# EAGLE design vco (EAGLE 7.4.0)

## Sheet 1 of 2
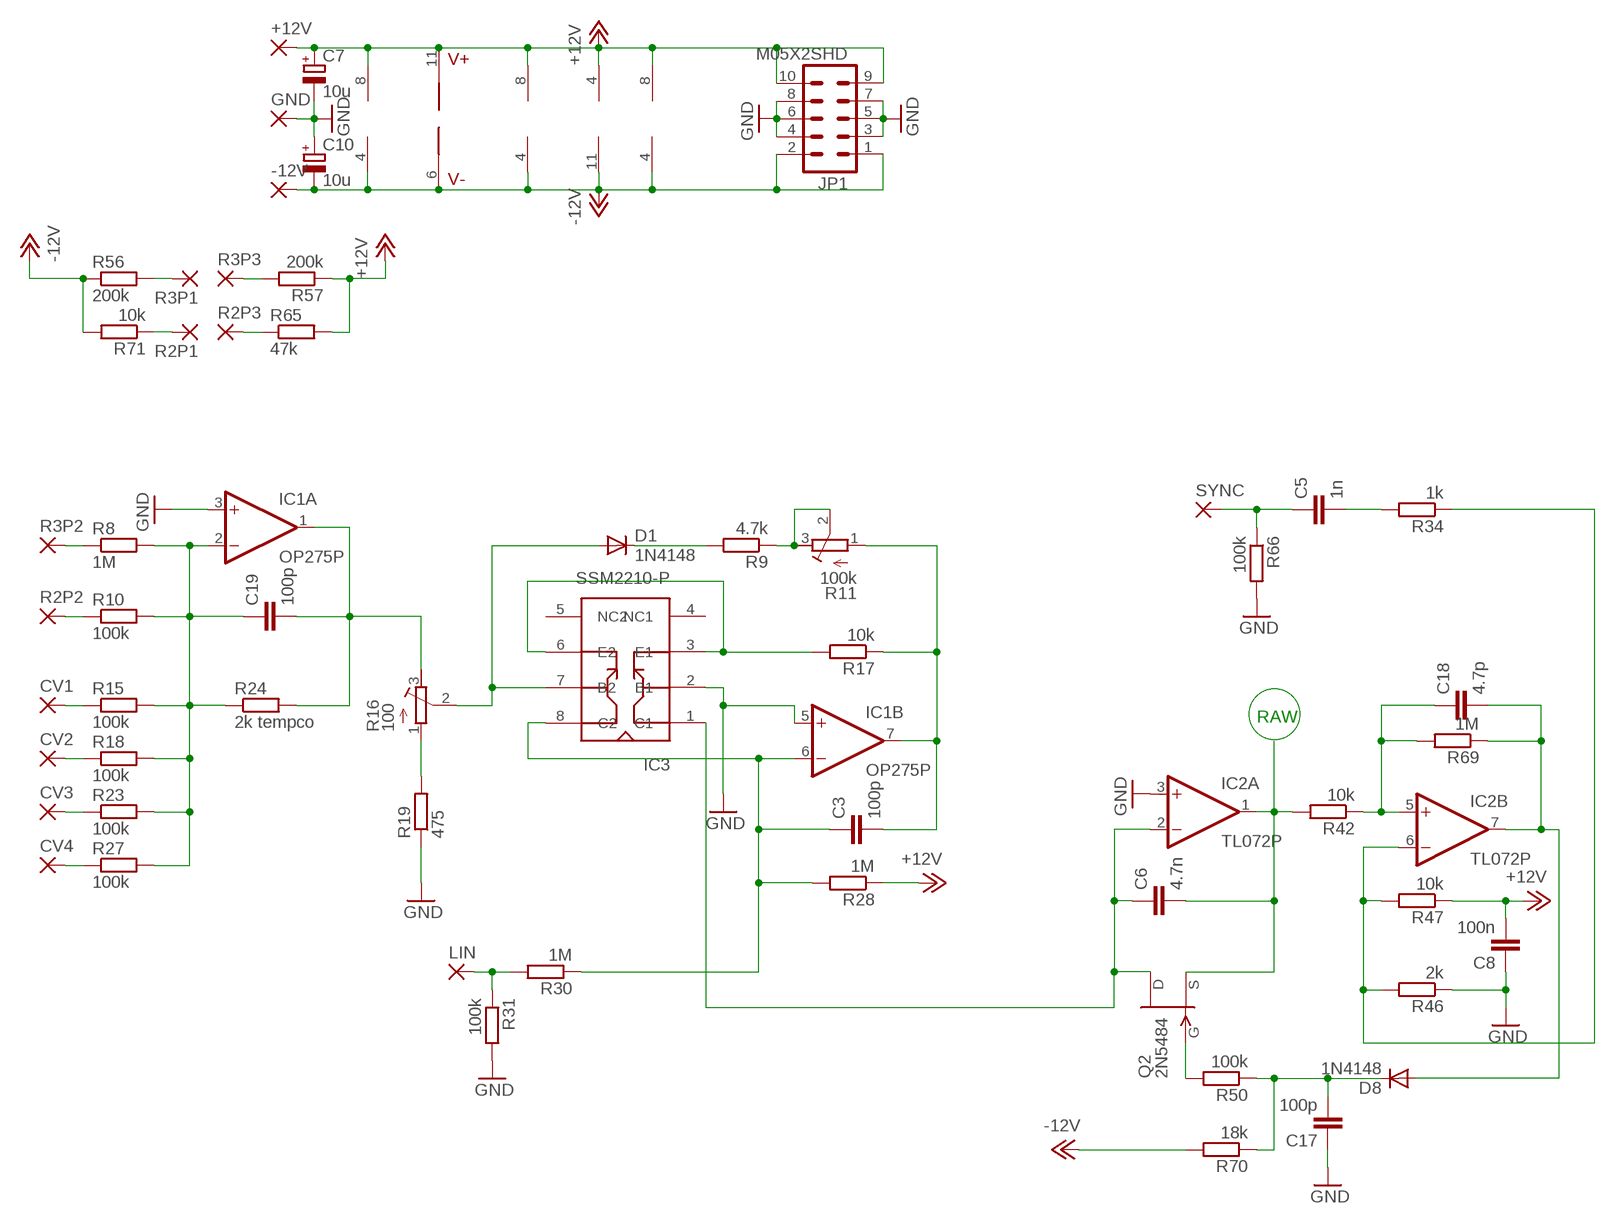
[diagram p0: schematic, sheet 1]

### Parts
+12V  2,54/1,0  [2,54/1,0]
-12V  2,54/1,0  [2,54/1,0]
C3  100p  C-EU050-045X075  [C050-045X075]
C5  1n  C-EU050-045X075  [C050-045X075]
C6  4.7n  C-EU050-045X075  [C050-045X075]
C7  10u  CPOL-EUE2.5-7  [E2,5-7]
C8  100n  C-EU050-045X075  [C050-045X075]
C10  10u  CPOL-EUE2.5-7  [E2,5-7]
C17  100p  C-EU050-045X075  [C050-045X075]
C18  4.7p  C-EU050-045X075  [C050-045X075]
C19  100p  C-EU050-045X075  [C050-045X075]
CV1  2,54/1,0  [2,54/1,0]
CV2  2,54/1,0  [2,54/1,0]
CV3  2,54/1,0  [2,54/1,0]
CV4  2,54/1,0  [2,54/1,0]
D1  1N4148  1N4148DO35-7  [DO35-7]
D8  1N4148  1N4148DO35-7  [DO35-7]
GND  2,54/1,0  [2,54/1,0]
IC1  OP275P  [DIL08]
IC2  TL072P  [DIL08]
IC3  SSM2210-P  [DIL08]
IC4  TL074P  [DIL14]
IC5  LM13700N  [DIL16]
IC6  TL072P  [DIL08]
JP1  M05X2SHD  [2X5-SHROUDED]
LIN  2,54/1,0  [2,54/1,0]
Q2  2N5484  [TO92-]
R2P1  2,54/1,0  [2,54/1,0]
R2P2  2,54/1,0  [2,54/1,0]
R2P3  2,54/1,0  [2,54/1,0]
R3P1  2,54/1,0  [2,54/1,0]
R3P2  2,54/1,0  [2,54/1,0]
R3P3  2,54/1,0  [2,54/1,0]
R8  1M  R-EU_0309/V  [0309V]
R9  4.7k  R-EU_0309/V  [0309V]
R10  100k  R-EU_0309/V  [0309V]
R11  100k  R-TRIMM64W  [RTRIM64W]
R15  100k  R-EU_0309/V  [0309V]
R16  100  R-TRIMM64W  [RTRIM64W]
R17  10k  R-EU_0309/V  [0309V]
R18  100k  R-EU_0309/V  [0309V]
R19  475  R-EU_0309/V  [0309V]
R23  100k  R-EU_0309/V  [0309V]
R24  2k tempco  R-EU_0309/12  [0309/12]
R27  100k  R-EU_0309/V  [0309V]
R28  1M  R-EU_0309/V  [0309V]
R30  1M  R-EU_0309/V  [0309V]
R31  100k  R-EU_0309/V  [0309V]
R34  1k  R-EU_0309/V  [0309V]
R42  10k  R-EU_0309/V  [0309V]
R46  2k  R-EU_0309/V  [0309V]
R47  10k  R-EU_0309/V  [0309V]
R50  100k  R-EU_0309/V  [0309V]
R56  200k  R-EU_0309/V  [0309V]
R57  200k  R-EU_0309/V  [0309V]
R65  47k  R-EU_0309/V  [0309V]
R66  100k  R-EU_0309/V  [0309V]
R69  1M  R-EU_0309/V  [0309V]
R70  18k  R-EU_0309/V  [0309V]
R71  10k  R-EU_0309/V  [0309V]
SYNC  2,54/1,0  [2,54/1,0]

### Nets
+12V: +12V.1(P) C7.+ C8.2 IC1.8(P:V+) IC2.8(P:V+) IC4.4(P:V+) IC5.11(V+) IC6.8(P:V+) JP1.9 JP1.10 R28.1 R47.1 R57.1 R65.2 ; also sheet 2
-12V: -12V.1(P) C10.- IC1.4(P:V-) IC2.4(P:V-) IC4.11(P:V-) IC5.6(V-) IC6.4(P:V-) JP1.1 JP1.2 R56.1 R70.2 R71.2 ; also sheet 2
GND: C7.- C8.1 C10.+ C17.1 GND.1(P) IC1.3(A:+IN) IC1.5(B:+IN) IC2.3(A:+IN) IC3.2(B1) JP1.3 JP1.4 JP1.5 JP1.6 JP1.7 JP1.8 R19.1 R31.2 R46.1 R66.2 ; also sheet 2
N$1: R3P1.1(P) R56.2
N$2: R2P1.1(P) R71.1
N$3: R2P3.1(P) R65.1
N$4: R3P3.1(P) R57.2
N$5: R3P2.1(P) R8.1
N$6: R2P2.1(P) R10.1
N$7: CV1.1(P) R15.1
N$8: CV2.1(P) R18.1
N$9: CV3.1(P) R23.1
N$10: CV4.1(P) R27.1
N$11: C19.1 IC1.2(A:-IN) R8.2 R10.2 R15.2 R18.2 R23.2 R24.1 R27.2
N$12: C19.2 IC1.1(A:OUT) R16.3(E) R24.2
N$13: Q2.1(G) R50.2
N$14: R16.1(A) R19.2
N$15: LIN.1(P) R30.2 R31.1
N$16: C3.1 IC1.6(B:-IN) IC3.8(C2) R28.2 R30.1
N$17: C3.2 IC1.7(B:OUT) R11.1(A) R17.1
N$18: IC3.3(E1) IC3.6(E2) R17.2
N$19: C17.2 D8.C R50.1 R70.1
N$20: C6.1 IC2.2(A:-IN) IC3.1(C1) Q2.3(D)
N$22: D1.A IC3.7(B2) R16.2(S)
N$23: D1.C R9.2
N$24: R9.1 R11.2(S) R11.3(E)
N$25: C18.1 IC2.5(B:+IN) R42.1 R69.2
N$26: C18.2 D8.A IC2.7(B:OUT) R69.1
N$27: IC2.6(B:-IN) R34.1 R46.2 R47.2
N$28: C5.2 R34.2
N$29: C5.1 R66.1 SYNC.1(P)
RAW: C6.2 IC2.1(A:OUT) Q2.2(S) R42.2 ; also sheet 2
Unconnected: IC3.4(NC1) IC3.5(NC2)

### Notes on the sheet
- RAW

## Sheet 2 of 2
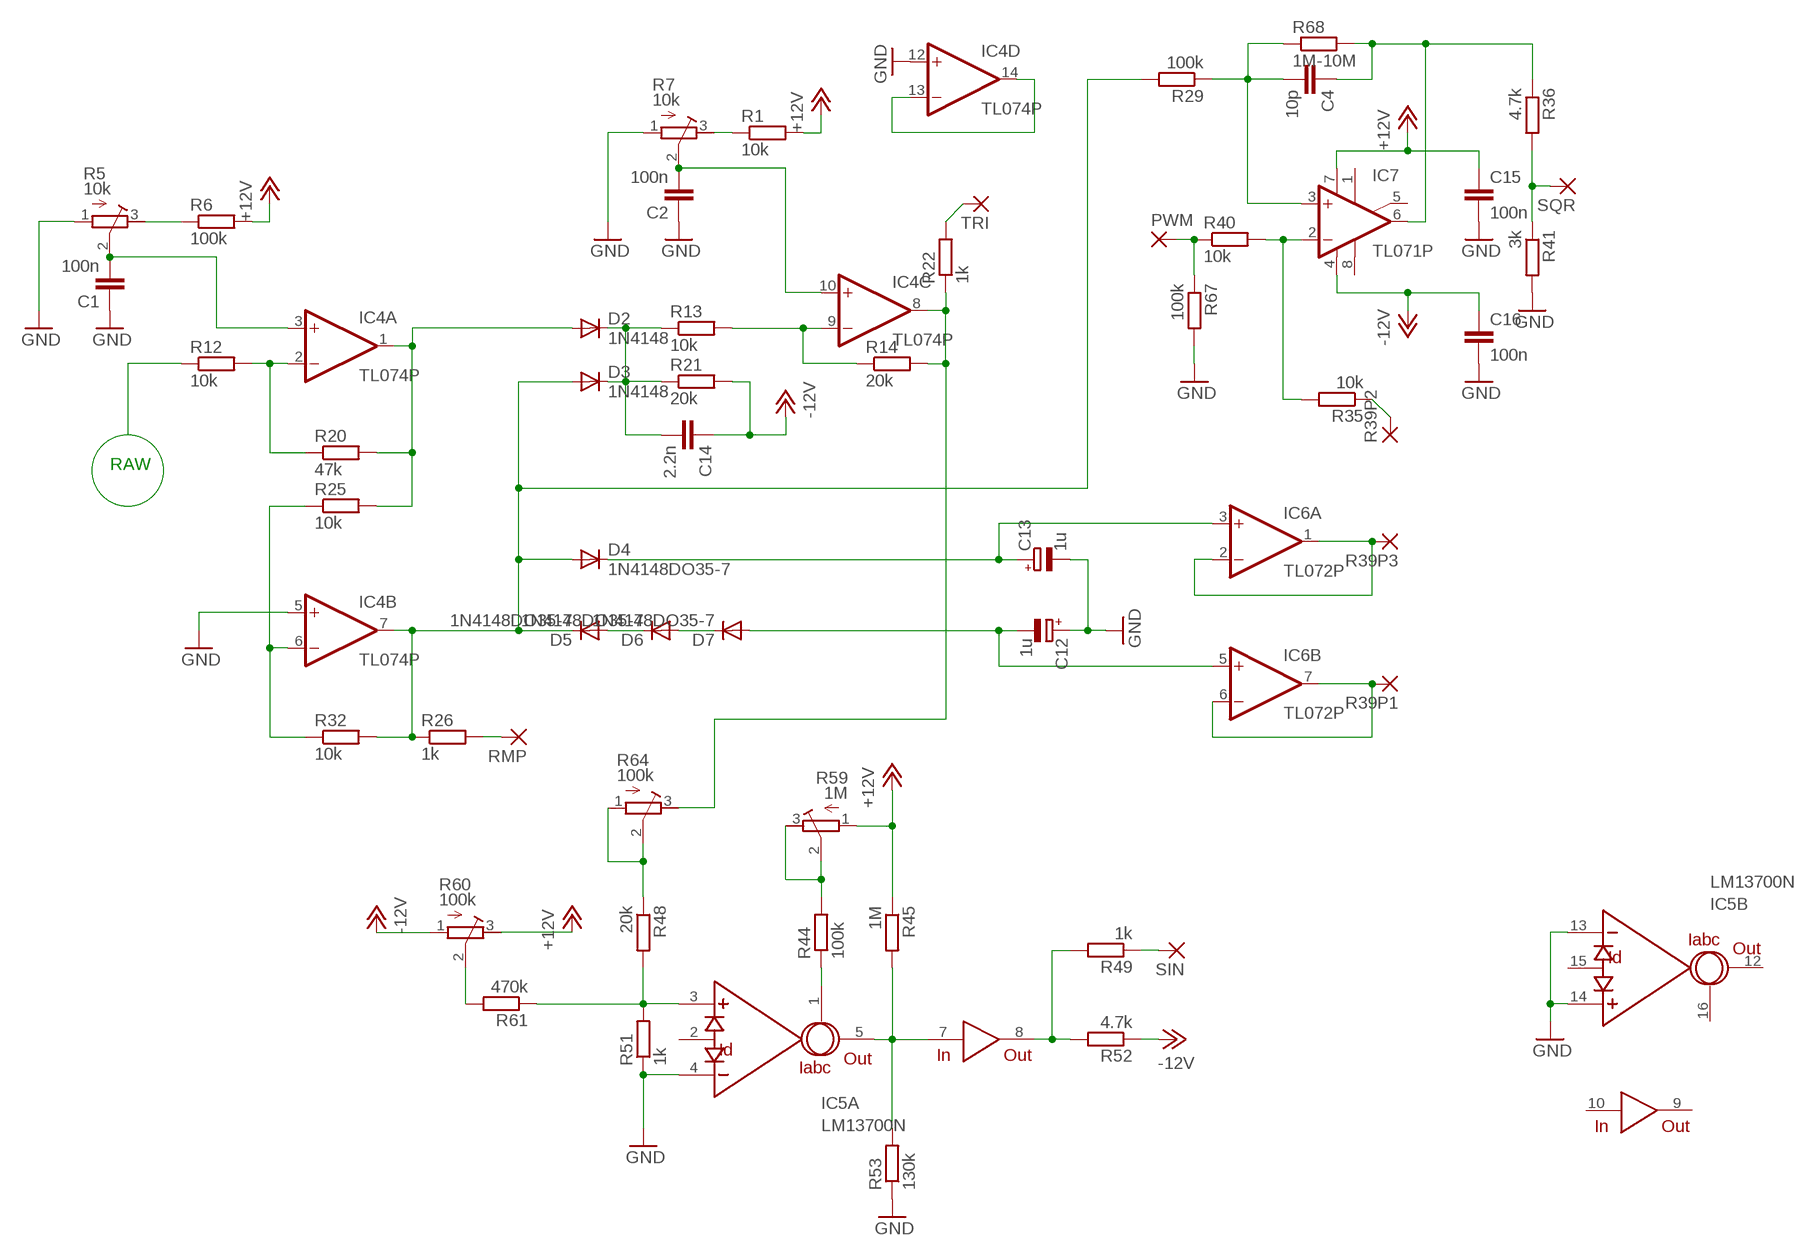
[diagram p1: schematic, sheet 2]

### Parts
C1  100n  C-EU050-045X075  [C050-045X075]
C2  100n  C-EU050-045X075  [C050-045X075]
C4  10p  C-EU050-045X075  [C050-045X075]
C12  1u  CPOL-EUE2.5-7  [E2,5-7]
C13  1u  CPOL-EUE2.5-7  [E2,5-7]
C14  2.2n  C-EU050-045X075  [C050-045X075]
C15  100n  C-EU050-035X075  [C050-035X075]
C16  100n  C-EU050-035X075  [C050-035X075]
D2  1N4148  1N4148DO35-7  [DO35-7]
D3  1N4148  1N4148DO35-7  [DO35-7]
D4  1N4148DO35-7  [DO35-7]
D5  1N4148DO35-7  [DO35-7]
D6  1N4148DO35-7  [DO35-7]
D7  1N4148DO35-7  [DO35-7]
IC7  TL071P  [DIL08]
PWM  2,54/1,0  [2,54/1,0]
R1  10k  R-EU_0309/V  [0309V]
R5  10k  R-TRIMM64W  [RTRIM64W]
R6  100k  R-EU_0309/V  [0309V]
R7  10k  R-TRIMM64W  [RTRIM64W]
R12  10k  R-EU_0309/V  [0309V]
R13  10k  R-EU_0309/10  [0309/10]
R14  20k  R-EU_0309/V  [0309V]
R20  47k  R-EU_0309/V  [0309V]
R21  20k  R-EU_0309/V  [0309V]
R22  1k  R-EU_0309/V  [0309V]
R25  10k  R-EU_0309/V  [0309V]
R26  1k  R-EU_0309/V  [0309V]
R29  100k  R-EU_0309/V  [0309V]
R32  10k  R-EU_0309/V  [0309V]
R35  10k  R-EU_0309/V  [0309V]
R36  4.7k  R-EU_0309/V  [0309V]
R39P1  2,54/1,0  [2,54/1,0]
R39P2  2,54/1,0  [2,54/1,0]
R39P3  2,54/1,0  [2,54/1,0]
R40  10k  R-EU_0309/V  [0309V]
R41  3k  R-EU_0309/V  [0309V]
R44  100k  R-EU_0309/V  [0309V]
R45  1M  R-EU_0309/V  [0309V]
R48  20k  R-EU_0309/V  [0309V]
R49  1k  R-EU_0309/V  [0309V]
R51  1k  R-EU_0309/V  [0309V]
R52  4.7k  R-EU_0309/V  [0309V]
R53  130k  R-EU_0309/V  [0309V]
R59  1M  R-TRIMM64W  [RTRIM64W]
R60  100k  R-TRIMM64W  [RTRIM64W]
R61  470k  R-EU_0309/V  [0309V]
R64  100k  R-TRIMM64W  [RTRIM64W]
R67  100k  R-EU_0309/V  [0309V]
R68  1M-10M  R-EU_0309/V  [0309V]
RMP  2,54/1,0  [2,54/1,0]
SIN  2,54/1,0  [2,54/1,0]
SQR  2,54/1,0  [2,54/1,0]
TRI  2,54/1,0  [2,54/1,0]

### Nets
+12V: C15.1 IC7.7(V+) R1.2 R6.2 R45.1 R59.1(A) R60.3(E) ; also sheet 1
-12V: C14.1 C16.1 IC7.4(V-) R21.2 R52.1 R60.1(A) ; also sheet 1
GND: C1.1 C2.1 C12.+ C13.- C15.2 C16.2 IC4.5(B:+IN) IC4.12(D:+IN) IC5.4(A:-IN) IC5.13(B:-IN) IC5.14(B:+IN) R5.1(A) R7.1(A) R41.2 R51.1 R53.1 R67.2 ; also sheet 1
N$21: C2.2 IC4.10(C:+IN) R7.2(S)
N$30: R1.1 R7.3(E)
N$31: R26.2 RMP.1(P)
N$32: R5.3(E) R6.1
N$33: C1.2 IC4.3(A:+IN) R5.2(S)
N$34: IC4.2(A:-IN) R12.2 R20.1
N$35: D2.A IC4.1(A:OUT) R20.2 R25.2
N$36: IC4.6(B:-IN) R25.1 R32.1
N$37: IC4.13(D:-IN) IC4.14(D:OUT)
N$38: D5.A D6.C
N$39: C14.2 D2.C D3.C R13.1 R21.1
N$40: D3.A D4.A D5.C IC4.7(B:OUT) R26.1 R29.2 R32.2
N$41: IC4.9(C:-IN) R13.2 R14.1
N$42: IC4.8(C:OUT) R14.2 R22.1 R64.3(E)
N$43: R22.2 TRI.1(P)
N$44: D6.A D7.C
N$45: C13.+ D4.C IC6.3(A:+IN)
N$46: C12.- D7.A IC6.5(B:+IN)
N$47: R60.2(S) R61.2
N$48: R35.1 R39P2.1(P)
N$49: R36.2 R41.1 SQR.1(P)
N$50: IC7.2(-IN) R35.2 R40.2
N$51: PWM.1(P) R40.1 R67.1
N$52: C4.2 IC7.3(+IN) R29.1 R68.1
N$53: C4.1 IC7.6(OUT) R36.1 R68.2
N$54: IC5.3(A:+IN) R48.2 R51.2 R61.1
N$56: R48.1 R64.1(A) R64.2(S)
N$57: IC6.1(A:OUT) IC6.2(A:-IN) R39P3.1(P)
N$58: IC6.6(B:-IN) IC6.7(B:OUT) R39P1.1(P)
N$59: IC5.5(A:OUT) IC5.7(IN) R45.2 R53.2
N$60: IC5.1(A:IABC) R44.1
N$61: IC5.8(OUT) R49.2 R52.2
N$62: R44.2 R59.2(S) R59.3(E)
N$63: R49.1 SIN.1(P)
RAW: R12.1 ; also sheet 1
Unconnected: IC5.2(A:ID) IC5.9(OUT) IC5.10(IN) IC5.12(B:OUT) IC5.15(B:ID) IC5.16(B:IABC) IC7.1(ON1) IC7.5(ON2) IC7.8(OPT)

### Notes on the sheet
- RAW

## Library data of the parts
+12V -12V CV1-CV4 GND LIN PWM R2P1-R2P3 R3P1-R3P3 R39P1-R39P3 RMP SIN SQR SYNC TRI = wirepad:2,54/1,0: THROUGH-HOLE PAD
C1-C6 C8 C14-C19 = rcl:C-EU: CAPACITOR, European symbol
C7 C10 C12 C13 = rcl:CPOL-EU: POLARIZED CAPACITOR, European symbol
D1-D8 = diode:1N4148: DIODE high speed (Philips)
IC1 = linear:OP275: Dual Very Low Noise Precision Operational Amplifier Source: http://www.analog.com/static/imported-files/data_sheets/OP270.pdf
IC2 IC6 = linear:TL072: OP AMP
IC3 = cavalier:SSM2210
IC4 = linear:TL074: OP AMP
IC5 = synthdiy:LM13700: National Dual OTA with buffers.
IC7 = linear:TL071: OP AMP
JP1 = SparkFun:M05X2: Header 5x2 Standard 10-pin dual row 0.1" header. Commonly used with AVR-ISP. Use with Spark Fun Electronics SKU: PRT-00778
Q2 = transistor-fet:?548*: N-Channel JFETs Source: VISHAY 2N5484.pdf Compatible: TO92 2N5245 J304 J305 U310 J308 J309 J310 TO72 2N4416 2N4416A 2N3823 2N4351 3N169 3N170 3N171 MFE3002 TO18 2N3796 2N3797 MFE825 Source: Motorola European Master Guide Pacge 3-59
R1 R6 R8-R10 R12-R15 R17-R32 R34-R36 R40-R42 R44-R53 R56 R57 R61 R65-R71 = rcl:R-EU_: RESISTOR, European symbol
R5 R7 R11 R16 R59 R60 R64 = rcl:R-TRIMM: Trimm resistor

## Board
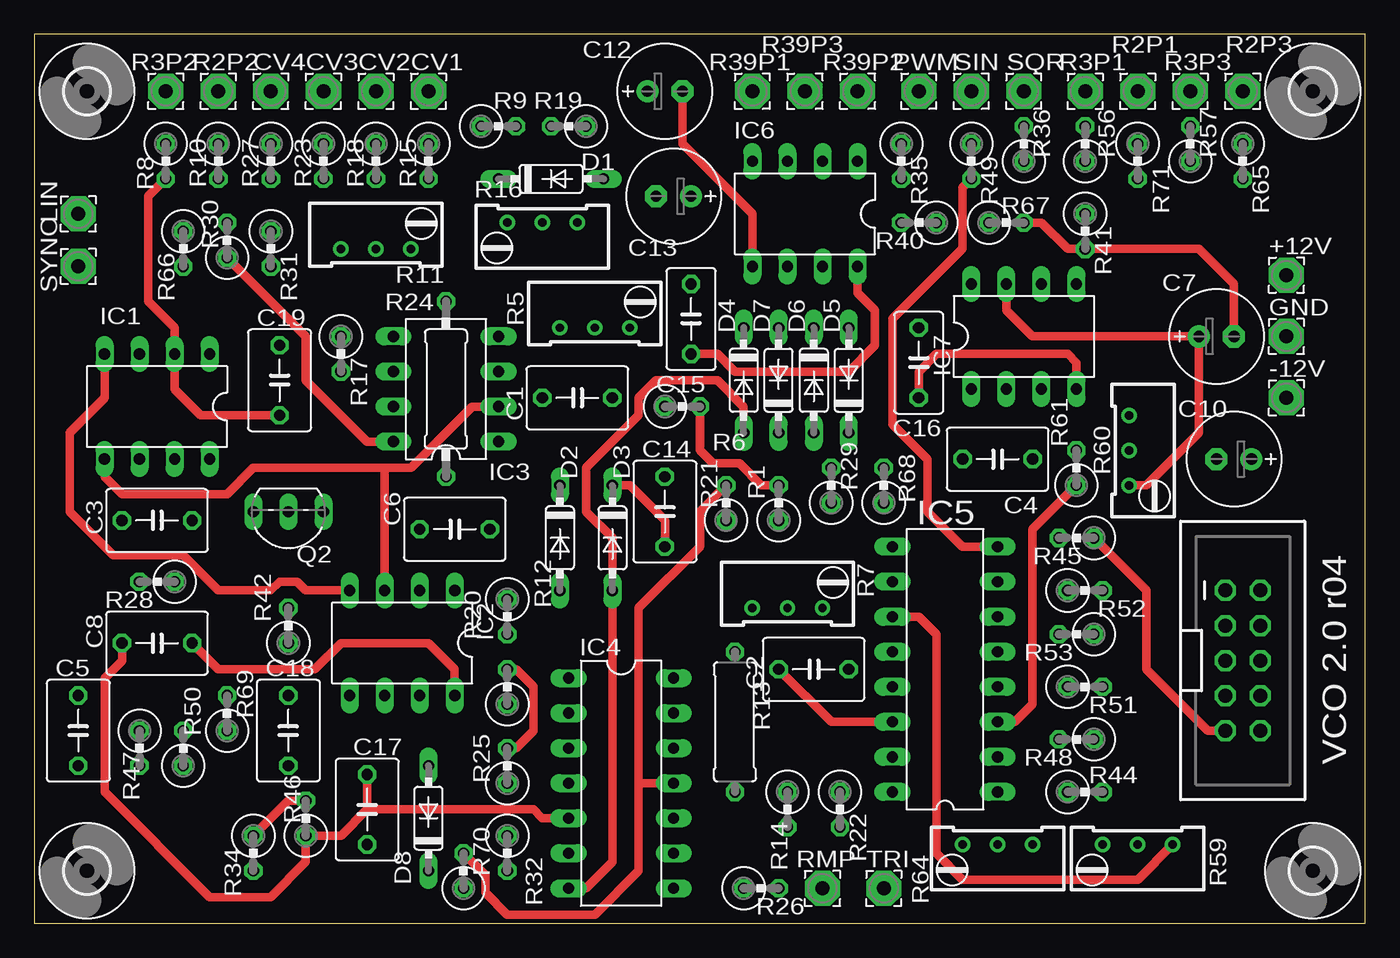
[diagram p2: board, top side]
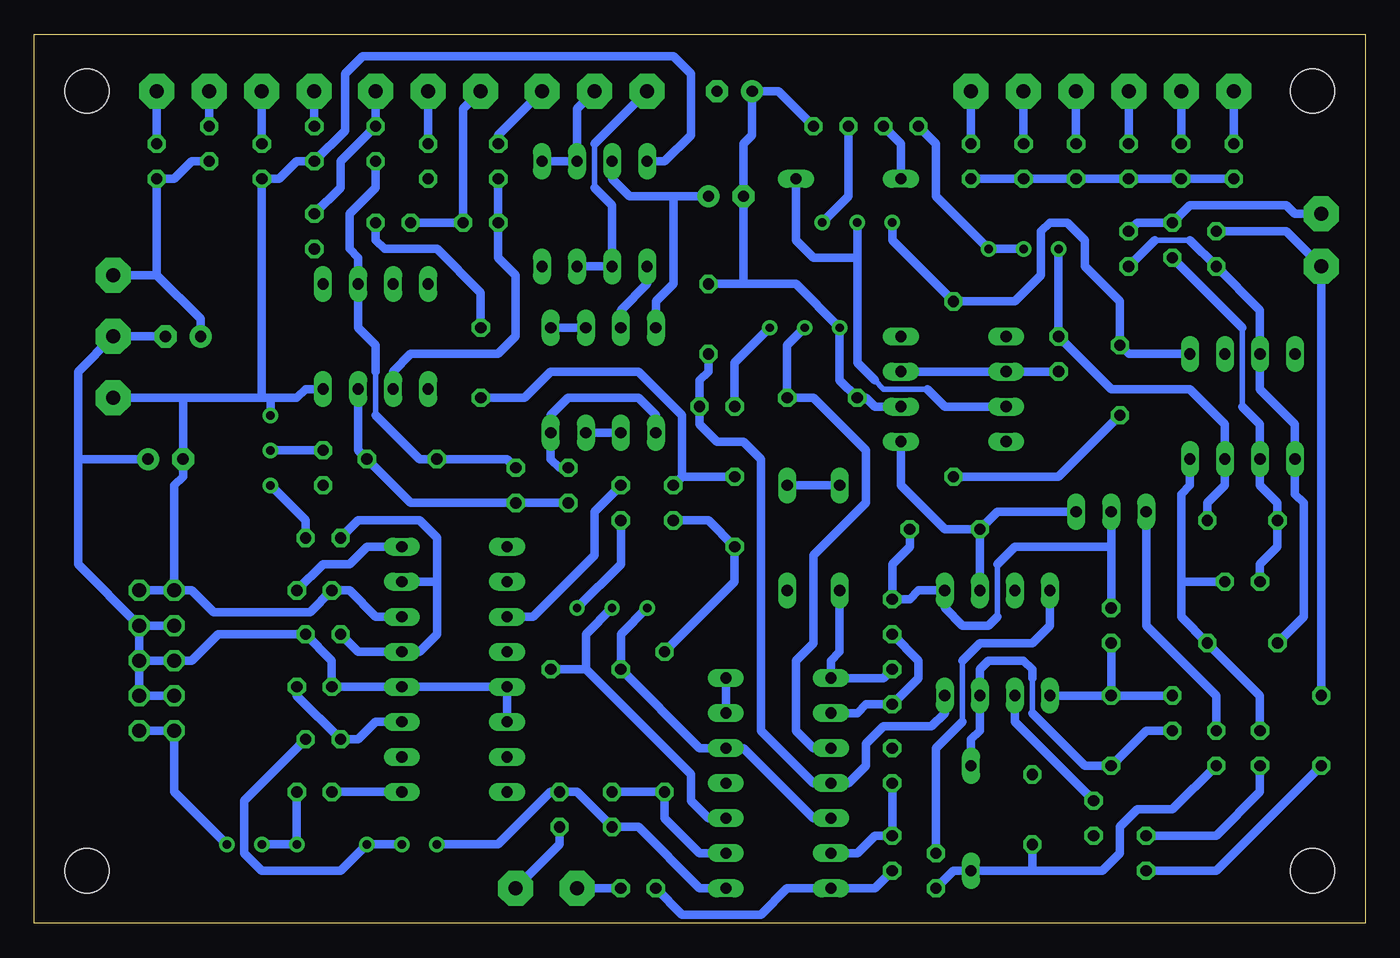
[diagram p3: board, bottom side, seen from below]

Size 96.5 x 64.44 mm. Coordinates in mm from the lower left corner, seen from the top.
Outline: 0,0 96.5,0 96.5,64.44 0,64.44 0,0
Copper layers (1*16): Top 0.035mm / dielectric 1.5mm / Bottom 0.035mm
Design rules "default": minimum track width 10mil, minimum drill 24mil, track to track 8mil, track to pad 8mil, pad to pad 8mil, via to via 8mil, smd to smd 8mil, copper to edge 40mil, drill to drill 8mil, minimum pad ring 10mil, minimum via ring 8mil, stop-mask expansion 4mil, vias tented up to drill 0mil, thermal gap 10mil

### Footprints (pad centres in the part's own frame; a part is rotated, then mirrored left to right if it is on the bottom)
2,54/1,0 = drill 1.016 pad 2.54 octagon: 1 0,0
C050-045X075 = drill 0.813 octagon: 1 -2.54,0; 2 2.54,0
E2,5-7 = drill 0.813 pad 1.6: + -1.27,0 | drill 0.813 pad 1.6 octagon: - 1.27,0
C050-035X075 = drill 0.813 octagon: 1 -2.54,0; 2 2.54,0
DO35-7 = drill 0.813 long: A 3.81,0; C -3.81,0
DIL08 = drill 0.813 pad 1.27 long: 1 -3.81,-3.81; 2 -1.27,-3.81; 3 1.27,-3.81; 4 3.81,-3.81; 5 3.81,3.81; 6 1.27,3.81; 7 -1.27,3.81; 8 -3.81,3.81
DIL14 = drill 0.813 long: 1 -7.62,-3.81; 2 -5.08,-3.81; 3 -2.54,-3.81; 4 0,-3.81; 5 2.54,-3.81; 6 5.08,-3.81; 7 7.62,-3.81; 8 7.62,3.81; 9 5.08,3.81; 10 2.54,3.81; 11 0,3.81; 12 -2.54,3.81; 13 -5.08,3.81; 14 -7.62,3.81
DIL16 = drill 0.813 long: 1 -8.89,-3.81; 2 -6.35,-3.81; 3 -3.81,-3.81; 4 -1.27,-3.81; 5 1.27,-3.81; 6 3.81,-3.81; 7 6.35,-3.81; 8 8.89,-3.81; 9 8.89,3.81; 10 6.35,3.81; 11 3.81,3.81; 12 1.27,3.81; 13 -1.27,3.81; 14 -3.81,3.81; 15 -6.35,3.81; 16 -8.89,3.81
2X5-SHROUDED = drill 1.016 octagon: 1 -1.27,5.08; 2 1.27,5.08; 3 -1.27,2.54; 4 1.27,2.54; 5 -1.27,0; 6 1.27,0; 7 -1.27,-2.54; 8 1.27,-2.54; 9 -1.27,-5.08; 10 1.27,-5.08
TO92- = drill 0.813 long: 1 2.54,0; 2 0,0; 3 -2.54,0
0309V = drill 0.813 octagon: 1 -1.27,0; 2 1.27,0
RTRIM64W = drill 0.61: 1 1.27,-2.54; 2 1.27,0; 3 1.27,2.54
0309/10 = drill 0.813 octagon: 1 -5.08,0; 2 5.08,0
0309/12 = drill 0.813 octagon: 1 -6.35,0; 2 6.35,0
3,2 = hole 3.2: 0,0

### Placement (x,y rotation side)
+12V  90.81,46.99 0 top
-12V  90.81,38.1 0 top
C1  39.37,38.1 0 top
C2  56.52,18.41 0 top
C3  8.89,29.21 0 top
C4  69.85,33.66 0 top
C5  3.17,13.97 270 top
C6  30.48,28.57 0 top
C7  85.72,42.55 0 top
C8  8.89,20.32 0 top
C10  87,33.66 180 top
C12  45.72,60.33 0 top
C13  46.35,52.7 180 top
C14  45.72,29.84 270 top
C15  47.62,43.81 90 top
C16  64.14,40.64 90 top
C17  24.13,8.26 270 top
C18  18.41,13.97 270 top
C19  17.78,39.37 90 top
CV1  28.57,60.33 0 top
CV2  24.77,60.33 0 top
CV3  20.95,60.33 0 top
CV4  17.14,60.33 0 top
D1  37.47,53.98 0 top
D2  38.1,27.94 270 top
D3  41.91,27.94 270 top
D4  51.44,39.37 270 top
D5  59.05,39.37 90 top
D6  56.52,39.37 270 top
D7  53.98,39.37 90 top
D8  28.57,7.62 90 top
GND  90.81,42.55 0 top
IC1  8.89,37.47 180 top
IC2  26.67,20.32 180 top
IC3  29.84,38.73 90 top
IC4  42.55,10.16 270 top
IC5  66.04,18.41 90 top
IC6  55.88,51.44 180 top
IC7  71.75,42.55 0 top
JP1  87.63,19.05 0 top
LIN  3.17,51.44 0 top
PWM  64.14,60.33 90 top
Q2  18.41,29.84 180 top
R1  53.98,30.48 90 top
R2P1  80.01,60.33 0 top
R2P2  13.34,60.33 0 top
R2P3  87.63,60.33 0 top
R3P1  76.2,60.33 0 top
R3P2  9.53,60.33 0 top
R3P3  83.82,60.33 0 top
R5  40.64,44.45 270 top
R6  46.99,37.47 0 top
R7  54.61,24.13 270 top
R8  9.53,55.24 270 top
R9  33.66,57.78 0 top
R10  13.34,55.24 270 top
R11  24.77,50.16 270 top
R12  34.29,22.23 270 top
R13  50.8,14.61 270 top
R14  54.61,8.26 270 top
R15  28.57,55.24 270 top
R16  36.83,49.53 90 top
R17  22.23,41.27 270 top
R18  24.77,55.24 270 top
R19  38.73,57.78 180 top
R20  34.29,17.14 90 top
R21  50.16,30.48 90 top
R22  58.42,8.26 270 top
R23  20.95,55.24 270 top
R24  29.84,38.73 90 top
R25  34.29,11.43 90 top
R26  52.7,2.54 0 top
R27  17.14,55.24 270 top
R28  8.89,24.77 180 top
R29  57.78,31.75 90 top
R30  13.97,49.53 90 top
R31  17.14,48.9 270 top
R32  34.29,5.08 270 top
R34  15.88,5.08 270 top
R35  62.87,55.24 270 top
R36  71.75,56.52 90 top
R39P1  52.07,60.33 90 top
R39P2  59.69,60.33 90 top
R39P3  55.88,60.33 90 top
R40  64.14,50.8 180 top
R41  76.2,50.16 270 top
R42  18.41,21.59 90 top
R44  76.2,9.53 0 top
R45  75.56,27.94 180 top
R46  19.68,7.62 90 top
R47  7.62,12.7 270 top
R48  75.56,13.34 180 top
R49  67.94,55.24 270 top
R50  10.79,12.7 90 top
R51  76.2,17.14 0 top
R52  76.2,24.13 0 top
R53  75.56,20.95 180 top
R56  76.2,56.52 90 top
R57  83.82,56.52 90 top
R59  80.01,4.45 90 top
R60  80.64,34.29 180 top
R61  75.56,33.02 90 top
R64  69.85,4.45 90 top
R65  87.63,55.24 270 top
R66  10.79,48.9 270 top
R67  70.48,50.8 0 top
R68  61.59,31.75 90 top
R69  13.97,15.24 90 top
R70  31.11,3.81 90 top
R71  80.01,55.24 270 top
RMP  57.15,2.54 0 top
SIN  67.94,60.33 90 top
SQR  71.75,60.33 90 top
SYNC  3.17,47.62 0 top
TRI  61.59,2.54 0 top
U$1  [3,2]  3.81,60.33 0 top
U$2  [3,2]  92.71,60.33 0 top
U$3  [3,2]  92.71,3.81 0 top
U$4  [3,2]  3.81,3.81 0 top

### Tracks (layer width: path | path; a pad name or v marks a point on that pad's centre or on a via)
+12V
  Top 0.61: R45.1 80.64,24.13 80.64,18.41 85.09,13.97 JP1.9 | R60.3 80.64,31.75 84.45,35.56 C7.+ 72.39,42.55 70.48,44.45 IC7.7 | R1.2 52.7,31.75 51.12,33.34 49.21,33.34 48.26,34.29 R6.2 | C15.1 49.53,41.27 50.8,40.01 59.05,40.01 60.96,41.91 60.96,44.45 59.69,45.72 IC6.8 | IC5.11 64.14,22.23 65.41,20.95 65.41,5.08 67.31,3.17 80.01,3.17 R59.1 | IC2.8 30.48,18.41 28.57,20.32 22.23,20.32 20.32,18.41 13.34,18.41 C8.2
  Bottom 0.61: R47.1 7.62,16.51 C8.2 13.34,22.23 13.34,24.77 | IC1.8 12.7,31.75 13.34,31.11 13.34,24.77 | R28.1 13.34,24.77 | R57.1 85.09,55.24 86.36,53.98 R65.2 87.63,46.99 | R1.2 55.88,29.84 55.88,26.67 60.33,22.23 IC5.11 | R45.1 76.83,29.21 R60.3 | R59.1 86.36,9.53 JP1.9 JP1.10 | 87.63,46.99 84.45,43.81 C7.+ | +12V.1 87.63,46.99 | IC2.8 30.48,15.24 31.43,14.29 34.92,14.29 36.2,13.02 36.2,11.43 37.47,10.16 IC4.4 40.01,10.16 43.81,13.97 43.81,33.66 45.09,34.92 46.99,34.92 48.26,36.2 R6.2 48.26,39.37 47.62,40.01 C15.1
-12V
  Top 0.61: IC1.4 5.08,38.1 2.54,35.56 2.54,29.84 5.71,26.67 10.79,26.67 13.34,24.13 17.14,24.13 17.78,24.77 19.05,24.77 19.68,24.13 IC2.4 | IC7.4 75.56,40.64 74.93,41.27 65.41,41.27 64.14,40.01 C16.1 | R70.2 32.7,3.49 32.7,2.22 34.29,0.64 40.64,0.64 43.81,3.81 43.81,10.16 | R21.2 48.26,29.84 48.26,27.3 43.81,22.86 43.81,10.16 | IC4.11 43.81,10.16
  Bottom 0.406: 29.21,14.61 29.21,19.05
  Bottom 0.61: IC5.6 71.75,22.23 73.66,24.13 R52.1 76.52,22.54 83.5,22.54 85.09,24.13 JP1.1 | JP1.2 JP1.1 | -12V.1 85.72,38.1 | IC7.4 76.83,38.73 77.47,38.1 79.38,38.1 | 85.72,38.1 C10.- 85.72,32.38 86.36,31.75 JP1.1 | 80.01,38.1 R71.2 78.74,53.98 77.47,55.24 R56.1 73.98,57.47 73.98,61.59 72.71,62.87 50.16,62.87 48.9,61.59 48.9,57.15 50.8,55.24 IC6.4 | 85.72,38.1 80.01,38.1 | 80.01,38.1 79.38,38.1 | R60.1 79.38,38.1 | C14.1 49.53,32.38 | 49.53,32.38 R21.2 | C16.1 60.96,38.1 59.05,40.01 52.7,40.01 49.53,36.83 49.53,32.38 | IC2.4 22.86,21.59 24.13,20.32 27.94,20.32 29.21,19.05 | 29.21,14.61 31.11,12.7 R70.2
GND
  Top 0.61: C8.1 6.35,19.05 5.08,17.78 5.08,9.53 12.7,1.91 17.14,1.91 19.68,4.45 R46.1 22.23,6.35 24.13,8.26 | C7.- 87,46.35 84.45,48.9 R41.2 74.93,48.9 73.03,50.8 R67.2 | IC3.2 31.75,37.47 27.3,33.02 25.4,33.02 | IC5.14 57.78,14.61 C2.1 | IC2.3 25.4,33.02 | 25.4,33.02 15.88,33.02 13.97,31.11 6.35,31.11 5.08,32.38 IC1.5 | 24.13,8.26 36.2,8.26 36.83,7.62 IC4.5 | C17.1 24.13,8.26
  Bottom 0.406: 12.7,49.53 15.24,49.53
  Bottom 0.61: 12.7,49.53 R66.2 7.62,44.45 IC1.3 7.62,38.73 5.08,36.2 IC1.5 5.08,31.11 4.45,30.48 4.45,22.23 C8.1 | 15.24,49.53 R31.2 | R19.1 42.55,60.33 C12.+ 44.45,57.15 45.09,56.52 C13.- 45.09,46.35 | IC3.2 35.56,37.47 36.2,38.1 C1.1 38.1,39.37 R5.1 41.27,46.35 45.09,46.35 | C15.2 45.09,46.35 | IC5.14 IC5.13 IC5.4 R51.1 74.93,19.05 R53.1 83.19,20.95 85.09,19.05 JP1.5 JP1.6 | C16.2 64.14,45.72 67.31,48.9 71.12,48.9 71.75,49.53 R67.2 | R7.1 53.98,20.95 C2.1 48.26,12.7 IC4.12 45.09,12.7 40.01,7.62 IC4.5 | JP1.7 JP1.8 JP1.6 | JP1.3 JP1.4 | JP1.4 JP1.6 | JP1.4 93.34,26.04 93.34,33.66 | 93.34,33.66 93.34,40.01 GND.1 C7.- | C10.+ 93.34,33.66
N$1
  Bottom 0.61: R3P1.1 R56.2
N$2
  Bottom 0.61: R2P1.1 R71.1
N$3
  Bottom 0.61: R2P3.1 R65.1
N$4
  Bottom 0.61: R3P3.1 R57.2
N$5
  Bottom 0.61: R8.1 R3P2.1
N$6
  Bottom 0.61: R10.1 R2P2.1
N$7
  Bottom 0.61: R15.1 CV1.1
N$8
  Bottom 0.61: R18.1 CV2.1
N$9
  Bottom 0.61: R23.1 CV3.1
N$10
  Bottom 0.61: R27.1 CV4.1
N$11
  Top 0.61: R8.2 8.26,52.7 8.26,45.09 10.16,43.18 IC1.2 10.16,38.73 12.06,36.83 C19.1
  Bottom 0.61: R15.2 R18.2 R23.2 R27.2 R10.2 R8.2 | R24.1 22.23,32.38 C19.1
N$12
  Bottom 0.61: IC1.1 17.14,41.27 C19.2 17.78,45.09 20.32,47.62 20.32,49.53 21.59,50.8 22.86,50.8 23.5,50.16 23.5,46.99 25.4,45.09 R24.2 34.29,49.53 R16.3
N$13
  Bottom 0.61: Q2.1 15.88,21.59 10.79,16.51 R50.2
N$14
  Bottom 0.61: R19.2 37.47,52.7 R16.1
N$15
  Bottom 0.61: LIN.1 5.08,51.44 5.71,52.07 12.7,52.07 R30.2 16.51,50.8 R31.1
N$16
  Top 0.61: IC3.8 24.13,34.92 19.68,39.37 19.68,42.55 R30.1
  Bottom 0.406: 8.89,37.47 8.89,43.18
  Bottom 0.61: R28.2 7.62,26.04 6.35,27.3 C3.1 6.35,30.48 7.62,31.75 IC1.6 7.62,36.2 8.89,37.47 | 8.89,43.18 R30.1
N$17
  Bottom 0.61: C3.2 11.43,30.48 10.16,31.75 IC1.7 10.16,36.2 12.7,38.73 18.41,38.73 R17.1 R11.1
N$18
  Bottom 0.61: IC3.3 IC3.6 R17.2
N$19
  Bottom 0.61: R50.1 13.97,8.26 16.51,8.26 17.78,6.99 17.78,5.08 19.05,3.81 24.13,3.81 | 24.13,3.81 D8.C 29.84,3.81 R70.1 | C17.2 24.13,3.81
N$20
  Bottom 0.61: Q2.3 26.67,29.84 C6.1 | IC2.2 C6.1 | IC3.1 33.66,31.75 30.48,28.57 C6.1
N$21
  Bottom 0.61: IC4.10 47.62,7.62 48.9,8.89 48.9,10.79 56.52,18.41 | 56.52,18.41 56.52,20.95 R7.2 | C2.2 56.52,18.41
N$22
  Bottom 0.406: 35.56,39.37 34.92,38.73 31.75,38.73
  Bottom 0.61: D1.A 41.27,49.53 40.01,48.26 36.83,48.26 | R16.2 36.83,48.26 | 35.56,39.37 36.83,40.64 36.83,48.26 | 31.75,38.73 30.48,37.47 IC3.7
N$23
  Bottom 0.61: R9.2 33.66,56.52 D1.C
N$24
  Bottom 0.61: R11.2 R11.3 31.11,52.7 31.11,56.52 R9.1
N$25
  Bottom 0.61: R69.2 C18.1 | IC2.5 C18.1 | C18.1 R42.1
N$26
  Bottom 0.406: 24.13,15.24 24.13,17.78
  Bottom 0.61: R69.1 15.88,13.97 C18.2 20.32,11.43 24.13,15.24 | D8.A 28.57,13.34 27.94,13.97 IC2.7 27.94,18.41 27.3,19.05 24.77,19.05 24.13,18.41 24.13,17.78
N$27
  Top 0.61: R34.1 18.41,8.89 R46.2
  Bottom 0.61: R47.2 7.62,9.53 10.79,6.35 R34.1 | R46.2 25.4,14.61 IC2.6
N$28
  Bottom 0.61: C5.2 10.79,3.81 R34.2
N$29
  Bottom 0.61: R66.1 5.71,50.16 SYNC.1 C5.1
N$30
  Bottom 0.61: R7.3 53.98,26.04 R1.1
N$31
  Bottom 0.61: RMP.1 R26.2
N$32
  Bottom 0.61: R6.1 45.72,40.64 R5.3
N$33
  Bottom 0.61: R5.2 41.91,41.91 C1.2 40.01,38.1 36.2,34.29 36.2,30.48 40.01,26.67 40.01,20.32 41.27,19.05 41.27,13.97 40.01,12.7 IC4.3
N$34
  Bottom 0.61: R12.2 32.38,19.05 32.38,17.78 R20.1 36.2,15.88 36.83,15.24 IC4.2
N$35
  Top 0.61: R25.2 34.92,12.7 36.2,13.97 36.2,17.14 34.92,18.41 R20.2
  Bottom 0.61: D2.A 38.1,19.68 38.73,19.05 IC4.1 34.92,17.78 R20.2
N$36
  Bottom 0.61: IC4.6 36.83,5.08 35.56,6.35 R32.1 R25.1
N$37
  Bottom 0.61: IC4.13 IC4.14
N$38
  Bottom 0.61: D5.A D6.C
N$39
  Top 0.61: C14.2 45.72,29.21 43.18,31.75 D3.C
  Bottom 0.61: R13.1 45.72,24.77 C14.2 47.62,29.21 R21.1 | D2.C D3.C
N$40
  Top 0.61: D4.A 51.44,37.47 49.53,39.37 45.09,39.37 43.81,38.1 43.81,36.83 40.01,33.02 40.01,29.84 41.91,27.94 D3.A 41.91,4.45 40.01,2.54 IC4.7
  Bottom 0.61: R32.2 35.56,2.54 IC4.7 41.91,2.54 43.81,0.64 49.53,0.64 R26.1 | D4.A 51.44,36.83 52.7,38.1 57.78,38.1 59.05,36.83 D5.C 59.05,33.66 58.42,33.02 R29.2
N$41
  Bottom 0.61: IC4.9 48.26,5.08 50.8,7.62 R13.2 R14.1
N$42
  Bottom 0.61: IC4.8 48.26,2.54 52.7,6.99 R14.2 57.15,9.53 R22.1 59.05,9.53 62.87,5.71 R64.3
N$43
  Bottom 0.61: R22.2 58.42,5.71 TRI.1
N$44
  Bottom 0.61: D7.C D6.A
N$45
  Bottom 0.61: D4.C 51.44,45.09 50.16,46.35 50.16,52.7 | C13.+ 50.16,52.7 | 50.16,52.7 53.34,52.7 54.61,53.98 IC6.3
N$46
  Top 0.61: IC6.5 52.07,51.44 46.99,56.52 C12.-
  Bottom 0.61: D7.A 53.98,44.45 52.07,46.35 IC6.5
N$47
  Bottom 0.61: R60.2 R61.2
N$48
  Bottom 0.61: R39P2.1 62.87,57.15 R35.1
N$49
  Bottom 0.61: SQR.1 R36.2 74.3,55.24 74.3,53.34 R41.1
N$50
  Bottom 0.61: IC7.2 70.48,40.01 69.22,41.27 62.87,41.27 61.59,42.55 61.59,46.99 62.87,48.26 R40.2 R35.2
N$51
  Bottom 0.61: PWM.1 65.41,59.05 R40.1 R67.1
N$52
  Bottom 0.61: IC7.3 73.03,34.29 C4.2 69.22,30.48 R68.1 R29.1
N$53
  Bottom 0.406: 71.75,36.83 71.75,40.01
  Bottom 0.61: R36.1 71.75,53.34 73.66,51.44 73.66,48.9 73.03,48.26 IC7.6 73.03,43.18 71.75,41.91 71.75,40.01 | 71.75,36.83 68.58,33.66 C4.1 62.23,33.66 R68.2
N$54
  Top 0.61: R61.1 72.39,28.57 72.39,15.88 71.12,14.61 IC5.3
  Bottom 0.61: IC5.3 71.75,14.61 73.03,13.34 R48.2 77.47,16.51 R51.2
N$56
  Bottom 0.61: R64.2 R64.1 74.3,3.81 80.01,3.81 81.28,5.08 81.28,8.89 R48.1
N$57
  Bottom 0.61: R39P3.1 57.15,59.05 IC6.2 IC6.1
N$58
  Bottom 0.406: 55.88,56.52 55.88,53.34
  Bottom 0.61: R39P1.1 55.88,56.52 | 55.88,53.34 54.61,52.07 IC6.6 IC6.7
N$59
  Bottom 0.61: R53.2 73.03,19.68 IC5.5 68.58,19.68 67.31,20.95 67.31,24.77 | 67.31,24.77 67.31,27.94 68.58,29.21 73.03,29.21 R45.2 | IC5.7 67.31,24.77
N$60
  Bottom 0.61: R44.1 IC5.1
N$61
  Top 0.61: IC5.8 67.31,27.3 64.77,29.84 64.77,33.66 62.23,36.2 62.23,43.81 67.31,48.9 67.31,53.34 R49.2
  Bottom 0.61: IC5.8 72.39,27.3 73.66,26.04 75.56,26.04 R52.2
N$62
  Bottom 0.61: R59.2 R59.3 R44.2
N$63
  Bottom 0.61: SIN.1 R49.1
RAW
  Bottom 0.406: 26.67,22.23 26.67,26.04
  Bottom 0.61: C6.2 33.02,27.3 34.29,26.04 R12.1 33.02,23.5 32.38,24.13 IC2.1 30.48,22.86 29.21,21.59 27.3,21.59 26.67,22.23 | R42.2 18.41,27.3 | 18.41,27.3 Q2.2 | 26.67,26.04 25.4,27.3 18.41,27.3

### Text on the board
tNames: VCO 2.0 r04